# EasyEDA schematic SCH_Cameron PCB_2022-05-20.json
TITLE: Main Board (Micro 32u4); REV: 1.0; Date: 2022-05-04; Sheet: 1/1; Company: Smyth Innovations
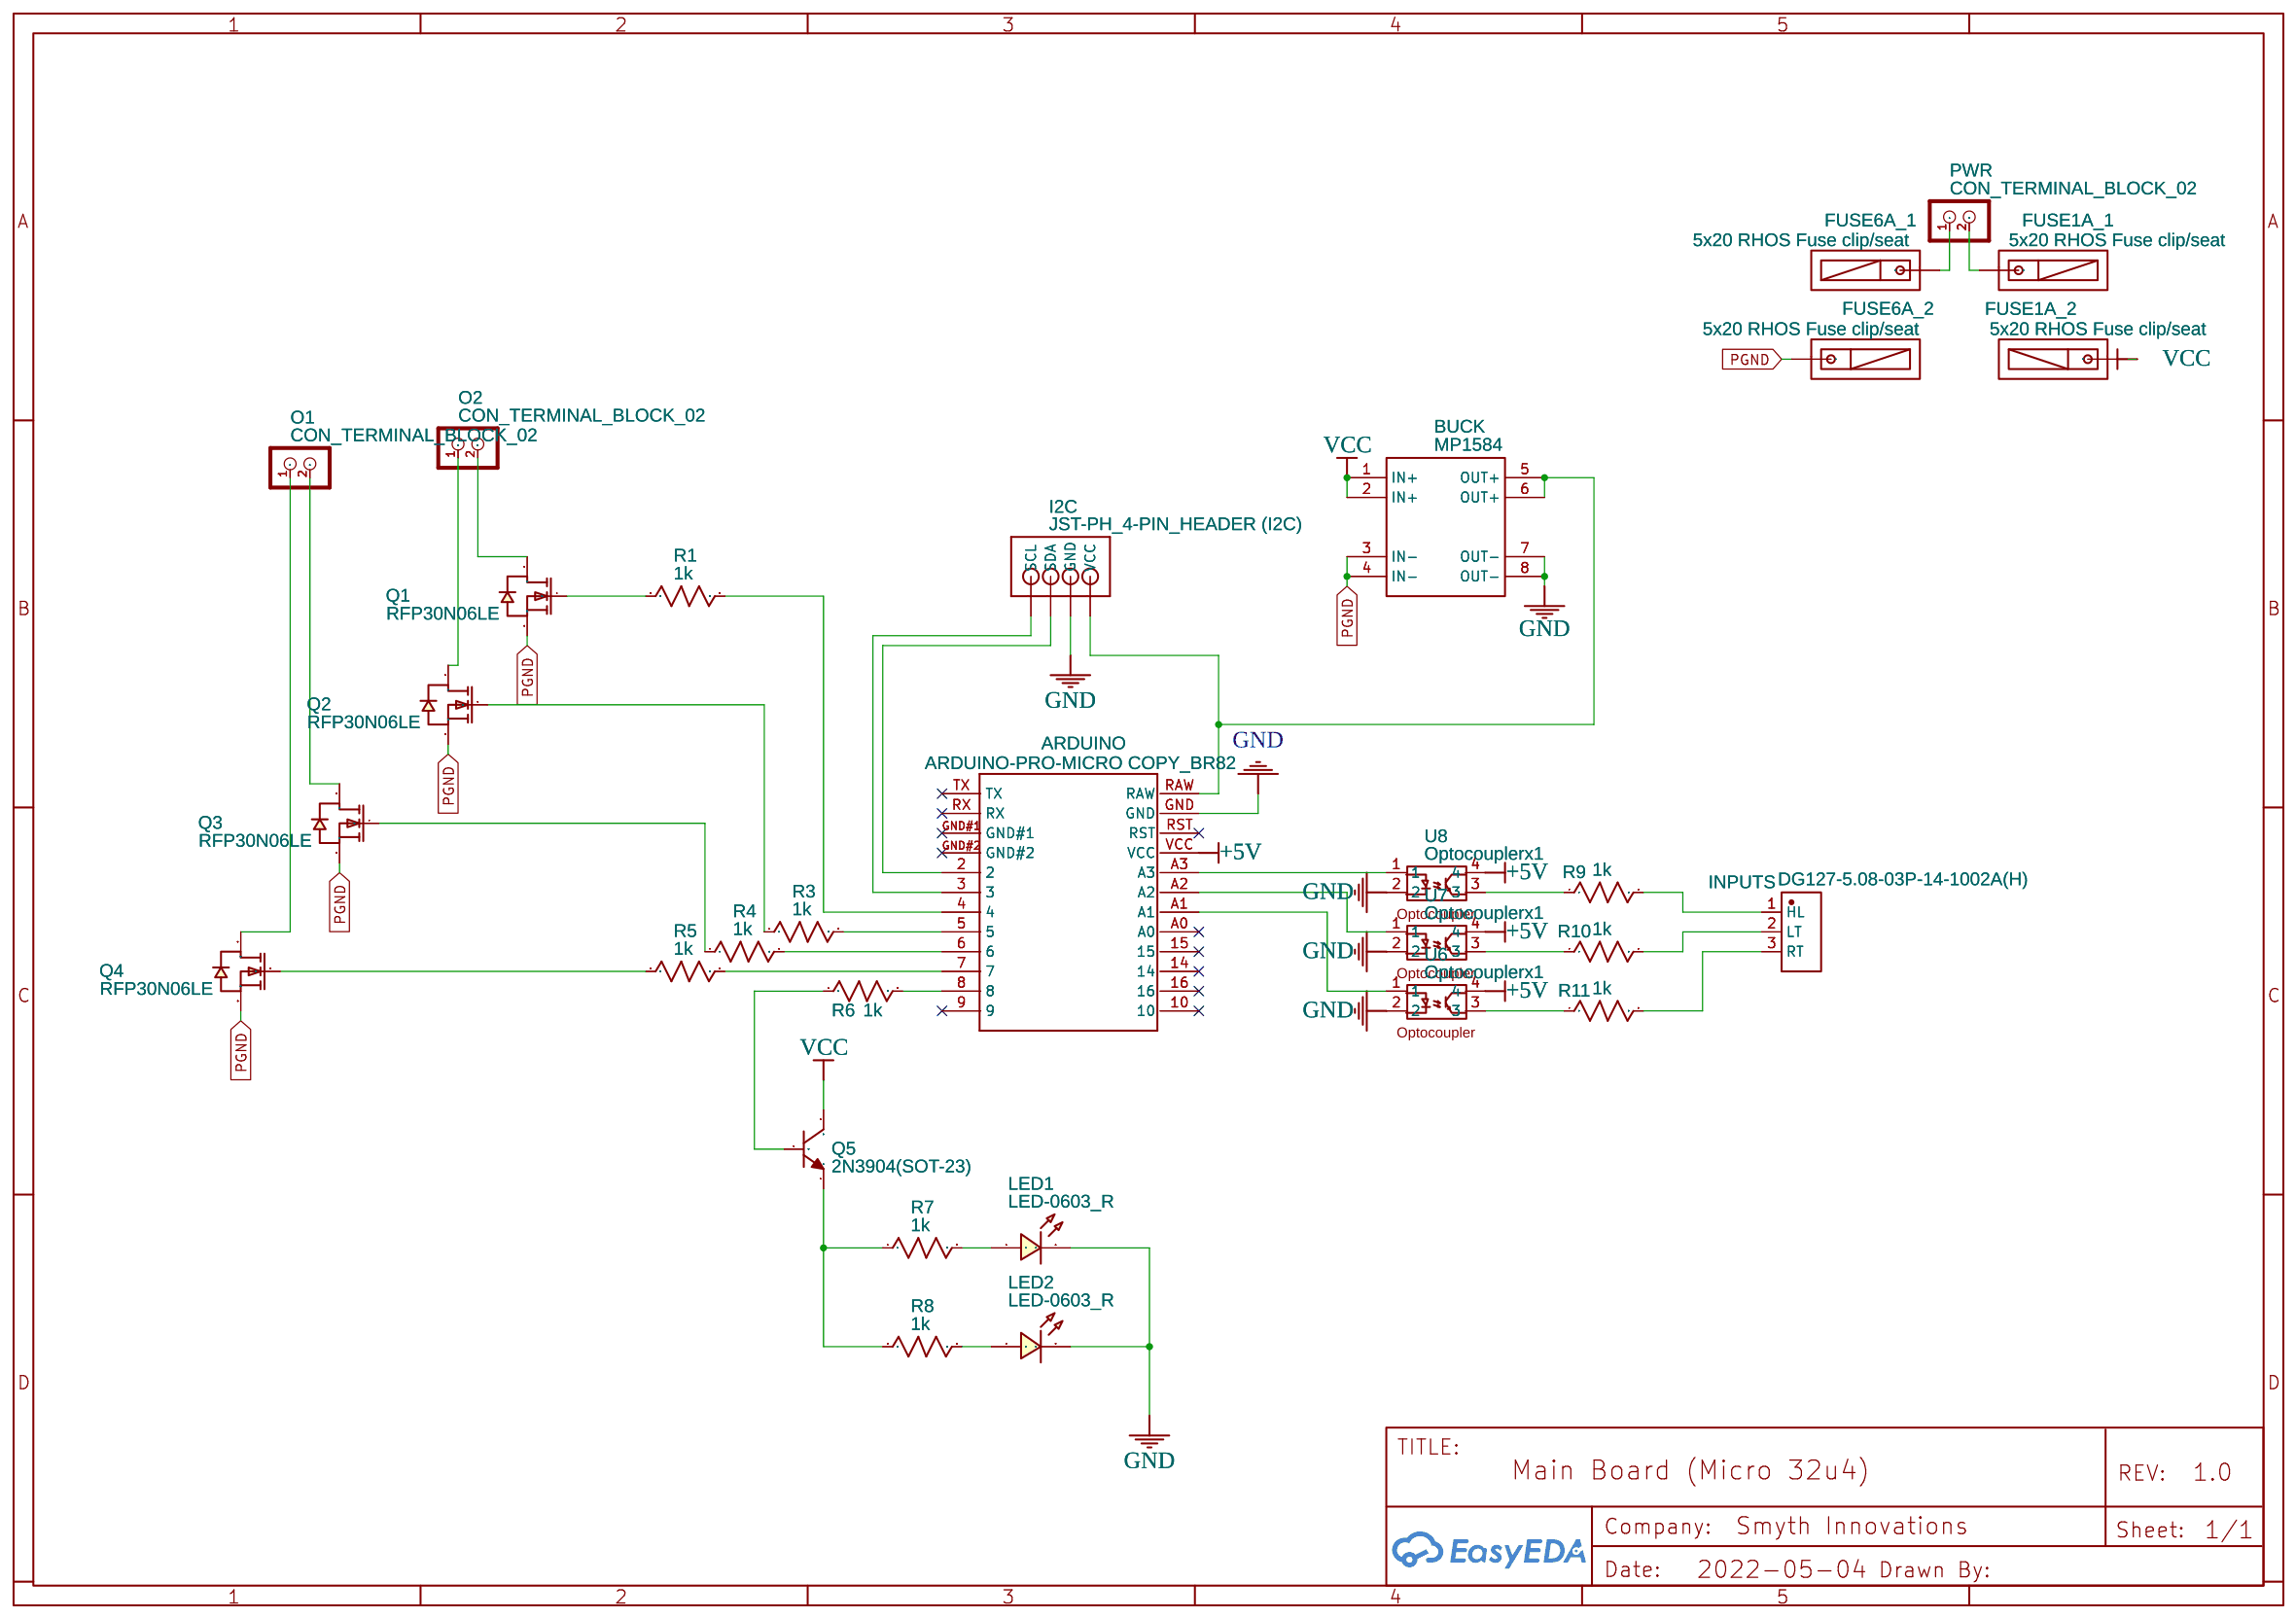
[diagram p0: schematic sheet]

## Parts
ARDUINO  ARDUINO-PRO-MICRO COPY_BR82  [ARDUINO-PRO-MICRO]
BUCK  MP1584  [MP1584EN-MODULE]
FUSE1A_1  5x20 RHOS Fuse clip/seat  [FUSE-TH_5X20RHOSFUSECLIP-SEAT]
FUSE1A_2  5x20 RHOS Fuse clip/seat  [FUSE-TH_5X20RHOSFUSECLIP-SEAT]
FUSE6A_1  5x20 RHOS Fuse clip/seat  [FUSE-TH_5X20RHOSFUSECLIP-SEAT]
FUSE6A_2  5x20 RHOS Fuse clip/seat  [FUSE-TH_5X20RHOSFUSECLIP-SEAT]
I2C  JST-PH_4-PIN_HEADER (I2C)  [JST_B4B-PH_HEADER]
INPUTS  DG127-5.08-03P-14-1002A(H)  [CONN-TH_DG127-5.08-03P-14-1002A-H]
LED1  LED-0603_R  [LED-5MM]
LED2  LED-0603_R  [LED-5MM]
O1  CON_TERMINAL_BLOCK_02  [TERMINAL_BLOCK_2P_5]
O2  CON_TERMINAL_BLOCK_02  [TERMINAL_BLOCK_2P_5]
PWR  CON_TERMINAL_BLOCK_02  [TERMINAL_BLOCK_2P_5]
Q1  RFP30N06LE  [TO-220AB-3_L10.4-W4.6-P2.54-L]
Q2  RFP30N06LE  [TO-220AB-3_L10.4-W4.6-P2.54-L]
Q3  RFP30N06LE  [TO-220AB-3_L10.4-W4.6-P2.54-L]
Q4  RFP30N06LE  [TO-220AB-3_L10.4-W4.6-P2.54-L]
Q5  2N3904(SOT-23)  [TO-92-3_L4.6-W3.6-P1.30-L_2N3904]
R1  1k  [R_AXIAL-0.3]
R3  1k  [R_AXIAL-0.3]
R4  1k  [R_AXIAL-0.3]
R5  1k  [R_AXIAL-0.3]
R6  1k  [R_AXIAL-0.3]
R7  1k  [R_AXIAL-0.3]
R8  1k  [R_AXIAL-0.3]
R9  1k  [R_AXIAL-0.3]
R10  1k  [R_AXIAL-0.3]
R11  1k  [R_AXIAL-0.3]
U6  Optocouplerx1  [OPTOCOUPLERX1]
U7  Optocouplerx1  [OPTOCOUPLERX1]
U8  Optocouplerx1  [OPTOCOUPLERX1]

## Library data of the parts
ARDUINO = ARDUINO-PRO-MICRO COPY_BR82: Contributor: bigb23
BUCK = MP1584: Supplier: LCSC; Contributor: lucas davalle
FUSE1A_1 FUSE1A_2 FUSE6A_1 FUSE6A_2 = 5x20 RHOS Fuse clip/seat: Supplier: LCSC; Manufacturer: XCFuse; Contributor: LCSC; Supplier Part: C3130; JLCPCB Part Class: Extended Part
I2C = JST-PH_4-PIN_HEADER
INPUTS = DG127-5.08-03P-14-1002A(H): Supplier: LCSC; Supplier Part: C669321; Manufacturer: DEGSON; Contributor: LCSC; JLCPCB Part Class: Extended Part
LED1 LED2 = LED-0603_R: Manufacturer: EVERLIGHT(台湾亿光); Manufacturer Part: 19-217/R6C-AL1M2VY/3T; Supplier Part: C72044; Supplier: LCSC; Contributor: LCEDA_01
O1 O2 PWR = CON_TERMINAL_BLOCK_02: Contributor: DangerousPrototype
Q1-Q4 = RFP30N06LE: Supplier: LCSC; Supplier Part: C878812; Manufacturer: VBsemi Elec; Contributor: LCSC; JLCPCB Part Class: Extended Part
Q5 = 2N3904(SOT-23): Supplier: LCSC; Manufacturer: KEC; Manufacturer Part: 2n3904S-RTK/PS; Supplier Part: C18536; Paste Type: SOT-23; Contributor: LCEDA_Lib
R1 = R_AXIAL-0.3_US: Contributor: LCEDA_Lib
R3-R11 = R_0603_US: Contributor: LCEDA_Lib
U6-U8 = Optocouplerx1: Manufacturer Part: x; Contributor: shahedaandcompany

## Nets
+5V: ARDUINO.VCC U6.4 U7.4 U8.4
GND: ARDUINO.GND BUCK.7(OUT-) BUCK.8(OUT-) I2C.P3(GND) LED1.2 LED2.2 U6.2 U7.2 U8.2
PGND: BUCK.3(IN-) BUCK.4(IN-) FUSE6A_2.1 Q1.3(S) Q2.3(S) Q3.3(S) Q4.3(S)
VCC: BUCK.1(IN+) BUCK.2(IN+) FUSE1A_2.1 Q5.3(C)
Net-(ARDUINO-2): ARDUINO.2 I2C.P2(SDA)
Net-(ARDUINO-3): ARDUINO.3 I2C.P1(SCL)
Net-(ARDUINO-4): ARDUINO.4 R1.2
Net-(ARDUINO-5): ARDUINO.5 R3.2
Net-(ARDUINO-6): ARDUINO.6 R4.2
Net-(ARDUINO-7): ARDUINO.7 R5.2
Net-(ARDUINO-8): ARDUINO.8 R6.2
Net-(ARDUINO-A1): ARDUINO.A1 U6.1
Net-(ARDUINO-A2): ARDUINO.A2 U7.1
Net-(ARDUINO-A3): ARDUINO.A3 U8.1
Net-(ARDUINO-RAW): ARDUINO.RAW BUCK.5(OUT+) BUCK.6(OUT+) I2C.P4(VCC)
Net-(FUSE1A_1-1): FUSE1A_1.1 PWR.2
Net-(FUSE6A_1-1): FUSE6A_1.1 PWR.1
Net-(INPUTS-1): INPUTS.1(HL) R9.2
Net-(INPUTS-2): INPUTS.2(LT) R10.2
Net-(INPUTS-3): INPUTS.3(RT) R11.2
Net-(LED1-1): LED1.1 R7.2
Net-(LED2-1): LED2.1 R8.2
Net-(O1-1): O1.1 Q4.2(D)
Net-(O1-2): O1.2 Q3.2(D)
Net-(O2-1): O2.1 Q2.2(D)
Net-(O2-2): O2.2 Q1.2(D)
Net-(Q1-1): Q1.1(G) R1.1
Net-(Q2-1): Q2.1(G) R3.1
Net-(Q3-1): Q3.1(G) R4.1
Net-(Q4-1): Q4.1(G) R5.1
Net-(Q5-1): Q5.1(E) R7.1 R8.1
Net-(Q5-2): Q5.2(B) R6.1
Net-(R9-1): R9.1 U8.3
Net-(R10-1): R10.1 U7.3
Net-(R11-1): R11.1 U6.3

Not connected (* = marked no-connect by the designer): ARDUINO 9* 10* 14* 15* 16* A0* GND#1* GND#2* RST* RX* TX*
